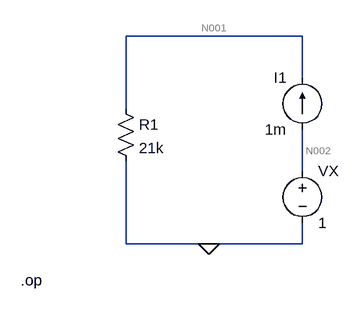
[diagram p0: schematic pag18es2.asc]
pag18es2.asc, the LTspice schematic file:
Version 4
SHEET 1 880 680
WIRE 224 -48 -48 -48
WIRE 224 16 224 -48
WIRE -48 64 -48 -48
WIRE 224 160 224 96
WIRE -48 272 -48 144
WIRE 80 272 -48 272
WIRE 224 272 224 240
WIRE 224 272 80 272
FLAG 80 272 0
SYMBOL voltage 224 144 R0
SYMATTR InstName VX
SYMATTR Value 1
SYMBOL current 224 96 R180
WINDOW 0 24 80 Left 2
WINDOW 3 24 0 Left 2
SYMATTR InstName I1
SYMATTR Value 1m
SYMBOL res -64 48 R0
SYMATTR InstName R1
SYMATTR Value 21k
TEXT -210 328 Left 2 !.op

The netlist it stands for:
* pag18es2.asc
VX N002 0 1
I1 N002 N001 1m
R1 N001 0 21k
.op
.backanno
.end

* Results of the author's LTspice run, read from the files saved beside the schematic
* Operating Point:
*   V(n002) = 1 V
*   V(n001) = 21 V
*   I(I1) = 1 mA
*   I(R1) = 1 mA
*   I(Vx) = -1 mA